# Altium schematic sheet USB.SchDoc
size A4
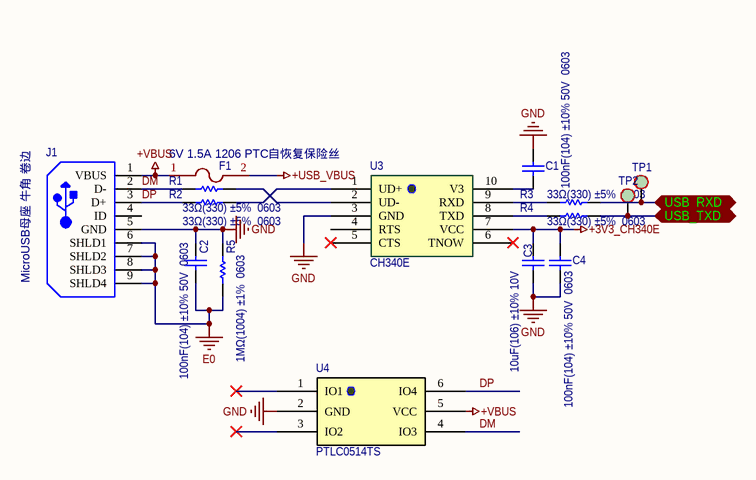
[diagram p0: USB.SchDoc]

## Parts
C1  100nF(104) ±10% 50V  0603  [C0603]
C2  100nF(104) ±10% 50V  0603  [C0603]
C3  10uF(106) ±10% 10V  [C0603]
C4  100nF(104) ±10% 50V  0603  [C0603]
F1  6V 1.5A 1206 PTC自恢复保险丝  [F1206]
J1  MicroUSB母座 牛角 卷边  [MICRO USB 母座 小牛角有柱 卷边]
R1  33Ω(330) ±5%  0603  [R0603]
R2  33Ω(330) ±5%  0603  [R0603]
R3  33Ω(330) ±5%  0603  [R0603]
R4  33Ω(330) ±5%  0603  [R0603]
R5  1MΩ(1004) ±1%  0603  [R0603]
TP1  NC  [TP]  (value not drawn)
TP2  NC  [TP]  (value not drawn)
U3  CH340E  [MSOP-10]
U4  PTLC0514TS  [SOT-236]

## Ports
USB_RXD, USB_TXD

## Nets
+3V3_CH340E: C3.2 C4.1 U3.7(VCC)
+USB_VBUS: F1.2
+VBUS: F1.1 J1.1(VBUS) U4.5(VCC)
E0: C2.1 J1.6(SHLD1) J1.7(SHLD2) J1.8(SHLD3) J1.9(SHLD4) R5.1
GND: C1.1 C2.2 C3.1 C4.2 J1.5(GND) R5.2 U3.3(GND) U4.2(GND)
DM: J1.2(D-) R1.2 U4.4(IO3)
DP: J1.3(D+) R2.2 U4.6(IO4)
USB_RXD: R3.1 TP1.1 ; port USB_RXD
USB_TXD: R4.1 TP2.1 ; port USB_TXD
NetC1_2: C1.2 U3.10(V3)
NetR1_1: R1.1 U3.2(UD-)
NetR2_1: R2.1 U3.1(UD+)
NetR3_2: R3.2 U3.9(RXD)
NetR4_2: R4.2 U3.8(TXD)

Not connected (* = marked no-connect by the designer): J1 4(ID); U3 4(RTS) 5(CTS)* 6(TNOW)*; U4 1(IO1)* 3(IO2)*

## Library data of the parts
C1-C4 = Cap: 0603贴片电容; Published: 8-Jun-2000; LatestRevisionDate: 17-Jul-2002; LatestRevisionNote: Re-released for DXP Platform.; PackageReference: RAD-0.3; Publisher: Altium Limited; PackageDescription: Radial Cap, Thru-Hole; 2 Leads; 0.3 in Pin Spacing
F1 = ASMD1206-150: 1206 PTC自恢复保险丝; BOM_Manufacturer: JDTFUSE; Contributor: LCSC; BOM_Paste Type: expand; BOM_Assembly Type: smtWeld; BOM_Supplier: LCSC; BOM_Manufacturer Part: ASMD1206-150; BOM_Supplier Part: C135341; spicePre: F; spiceSymbolName: ASMD1206-150
J1 = CMP-0029-00002-1: MicroUSB母座; Capacitance: 1 uF; Tolerance: 10%; ESR: 7.5 Ohm; Voltage Rating: 35 V; PackageDescription: USB Connector, 5 Position Surface Mount, Length 8 mm, Height 2.65 mm; DatasheetVersion: Aug-16; REACH SVHC: No SVHC; Package Quantity: 2000; ComponentLink1Description: Manufacturer URL; ComponentLink2URL: https://www.hirose.com/product/en/download_file/key_name/ZX62D-B-5P8/category/Catalog/doc_file_id/31704/?file_category_id=5&item_id=02420034000&is_series=; Length: 3.2 mm; ComponentLink1URL: https://www.hirose.com; Radiation Hardening: No; Height: 1.8 mm; Max Operating Temperature: 125degC; Weight: 0.000571 oz; Min Operating Temperature: -55degC; ComponentLink3Description: Package Specification; Width: 1.6 mm; Case Code (Metric): 3216; Mount: Surface Mount; ComponentLink2Description: Datasheet; Case Code (Imperial): 1206; ComponentLink3URL: https://www.hirose.com/product/en/download_file/key_name/ZX62D-B-5P8/category/Drawing%20(2D)/doc_file_id/36535/?file_category_id=6&item_id=02420034000&is_series=; Pins: 2; Resistance: 7.5 Ohm; Packaging: Tape and Reel; RoHSCompliant: True; Voltage Rating (DC): 35 V; Case/Package: 1206; PackageReference: ZX62D-B-5P8
R1-R5 = Res1: 0603贴片电阻; Published: 8-Jun-2000; LatestRevisionDate: 17-Jul-2002; LatestRevisionNote: Re-released for DXP Platform.; PackageReference: AXIAL-0.3; Publisher: Altium Limited; PackageDescription: Axial Device, Thru-Hole; 2 Leads; 0.3 in Pin Spacing
TP1 TP2 = TP: 测试点
U3 = CH340E: USB转串口IC